# EAGLE design IoT_PCB (EAGLE 9.6.2)
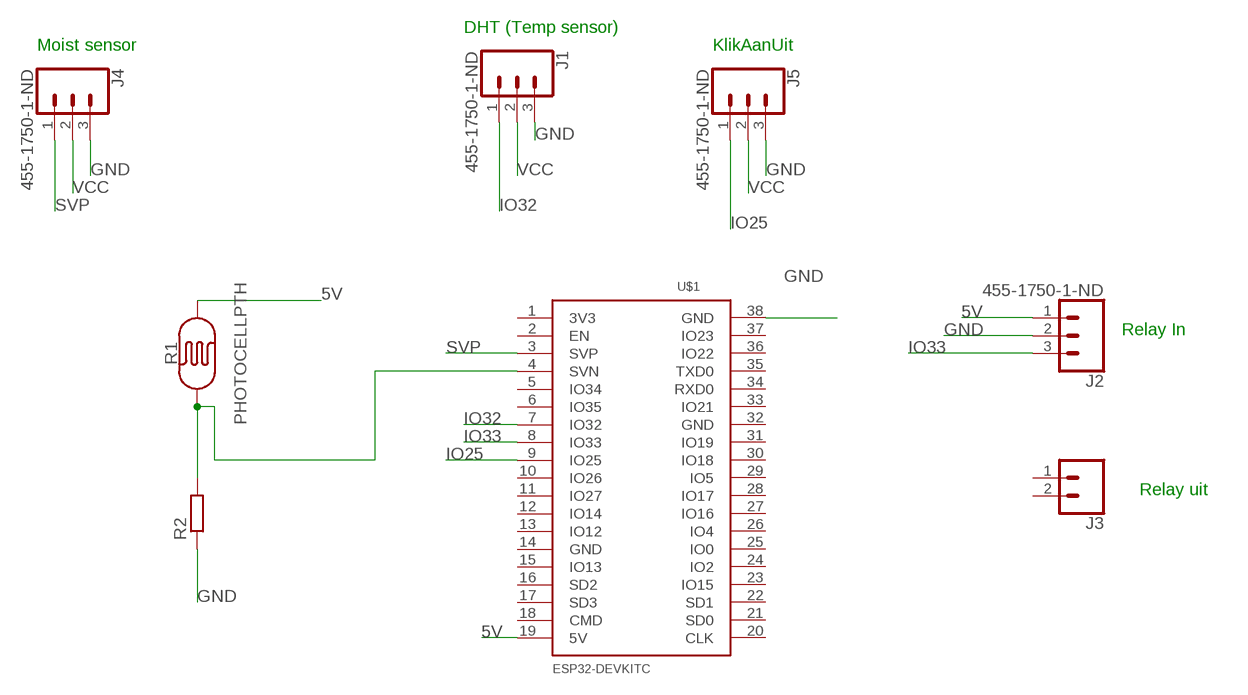
[diagram p0: schematic, sheet 1]

## Parts
J1  455-1750-1-ND  CONN_03  [1X03]
J2  455-1750-1-ND  CONN_03  [1X03]
J3  CONN_02  [1X02]
J4  455-1750-1-ND  CONN_03  [1X03]
J5  455-1750-1-ND  CONN_03  [1X03]
R1  PHOTOCELLPTH  [PHOTOCELL]
R2  R-EU_0207/10  [0207/10]
U$1  ESP32DEVKITC  [ESP32-DEVKITC]

## Nets
5V: J2.1 R1.2 U$1.19(5V)
GND: J1.3 J2.2 J4.3 J5.3 R2.1 U$1.38(GND)
IO25: J5.1 U$1.9(IO25)
IO32: J1.1 U$1.7(IO32)
IO33: J2.3 U$1.8(IO33)
N$1: R1.1 R2.2 U$1.4(SVN)
SVP: J4.1 U$1.3(SVP)
VCC: J1.2 J4.2 J5.2
Unconnected: J3.1 J3.2 U$1.1(3V3) U$1.2(EN) U$1.5(IO34) U$1.6(IO35) U$1.10(IO26) U$1.11(IO27) U$1.12(IO14) U$1.13(IO12) U$1.14(GND) U$1.15(IO13) U$1.16(SD2) U$1.17(SD3) U$1.18(CMD) U$1.20(CLK) U$1.21(SD0) U$1.22(SD1) U$1.23(IO15) U$1.24(IO2) U$1.25(IO0) U$1.26(IO4) U$1.27(IO16) U$1.28(IO17) U$1.29(IO5) U$1.30(IO18) U$1.31(IO19) U$1.32(GND) U$1.33(IO21) U$1.34(RXD0) U$1.35(TXD0) U$1.36(IO22) U$1.37(IO23)

## Notes on the sheet
- DHT (Temp sensor)
- Moist sensor | KlikAanUit
- Relay In
- Relay uit

## Library data of the parts
J1 J2 J4 J5 = SparkFun-Connectors:CONN_03: Multi connection point. Often used as Generic Header-pin footprint for 0.1 inch spaced/style header connections On any of the 0.1 inch spaced packages, you can populate with these: Break Away Headers - Straight <https://www.sparkfun.com/products/116> (PRT-00116) Break Away Male Headers - Right Angle <https://www.sparkfun.com/products/553> (PRT-00553) Female Headers <https://www.sparkfun.com/products/115> (PRT-00115) Break Away Headers - Machine Pin <https://www.sparkfun.com/products/117> (PRT-00117) Break Away Female Headers - Swiss Machine Pin <https://www.sparkfun.com/products/743> (PRT-00743) Stackable Header - 3 Pin (Female, 0.1") <https://www.sparkfun.com/products/13875> (PRT-13875) For SCREWTERMINALS and SPRING TERMINALS visit here: Screw Terimnals on SparkFun.com <https://www.sparkfun.com/search/results?term=Screw+Terminals> (5mm/3.5mm/2.54mm spacing) This device is also useful as a general connection point to wire up your design to another part of your project. Our various solder wires solder well into these plated through hole pads. Hook-Up Wire - Assortment (Stranded, 22 AWG) <https://www.sparkfun.com/products/11375> (PRT-11375) Hook-Up Wire - Assortment (Solid Core, 22 AWG) <https://www.sparkfun.com/products/11367> (PRT-11367) View the entire wire category on our website here <https://www.sparkfun.com/categories/141> Special notes: Molex polarized connector foot print use with SKU : PRT-08232 with associated crimp pins and housings.; PROD_ID: XXX-00000
J3 = SparkFun-Connectors:CONN_02: Multi connection point. Often used as Generic Header-pin footprint for 0.1 inch spaced/style header connections On any of the 0.1 inch spaced packages, you can populate with these: Break Away Headers - Straight <https://www.sparkfun.com/products/116> (PRT-00116) Break Away Male Headers - Right Angle <https://www.sparkfun.com/products/553> (PRT-00553) Female Headers <https://www.sparkfun.com/products/115> (PRT-00115) Break Away Headers - Machine Pin <https://www.sparkfun.com/products/117> (PRT-00117) Break Away Female Headers - Swiss Machine Pin <https://www.sparkfun.com/products/743> (PRT-00743) For SCREWTERMINALS and SPRING TERMINALS visit here: Screw Terimnals on SparkFun.com <https://www.sparkfun.com/search/results?term=Screw+Terminals> (5mm/3.5mm/2.54mm spacing) This device is also useful as a general connection point to wire up your design to another part of your project. Our various solder wires solder well into these plated through hole pads. Hook-Up Wire - Assortment (Stranded, 22 AWG) <https://www.sparkfun.com/products/11375> (PRT-11375) Hook-Up Wire - Assortment (Solid Core, 22 AWG) <https://www.sparkfun.com/products/11367> (PRT-11367) View the entire wire category on our website here <https://www.sparkfun.com/categories/141> Special notes: Molex polarized connector foot print use with: PRT-08233 with associated crimp pins and housings. 2.54_SCREWTERM for use with PRT-10571. 3.5mm Screw Terminal footprints for PRT-08084 5mm Screw Terminal footprints for use with PRT-08432
R1 = SparkFun-Sensors:PHOTOCELL: Photocell (Photodetector, Photo Resistor, CdS) This is a very small light sensor. A photocell changes (also called a photodetector, photo resistor, CdS or photoconductive cell) resistance depending on the amount of light it is exposed to. These little sensors make great ambient light triggers (when light in the room turns on, do something). Datasheet <http://cdn.sparkfun.com/datasheets/Sensors/LightImaging/SEN-09088.pdf> SparkFun Products Mini Photocell <https://www.sparkfun.com/products/9088> (SEN-09088); PROD_ID: COMP-09129; SF_ID: SEN-09088
R2 = rcl:R-EU_: RESISTOR, European symbol; SPICEPREFIX: R
U$1 = ESP32-DEVKITC_1000mil:ESP32DEVKITC

## Board
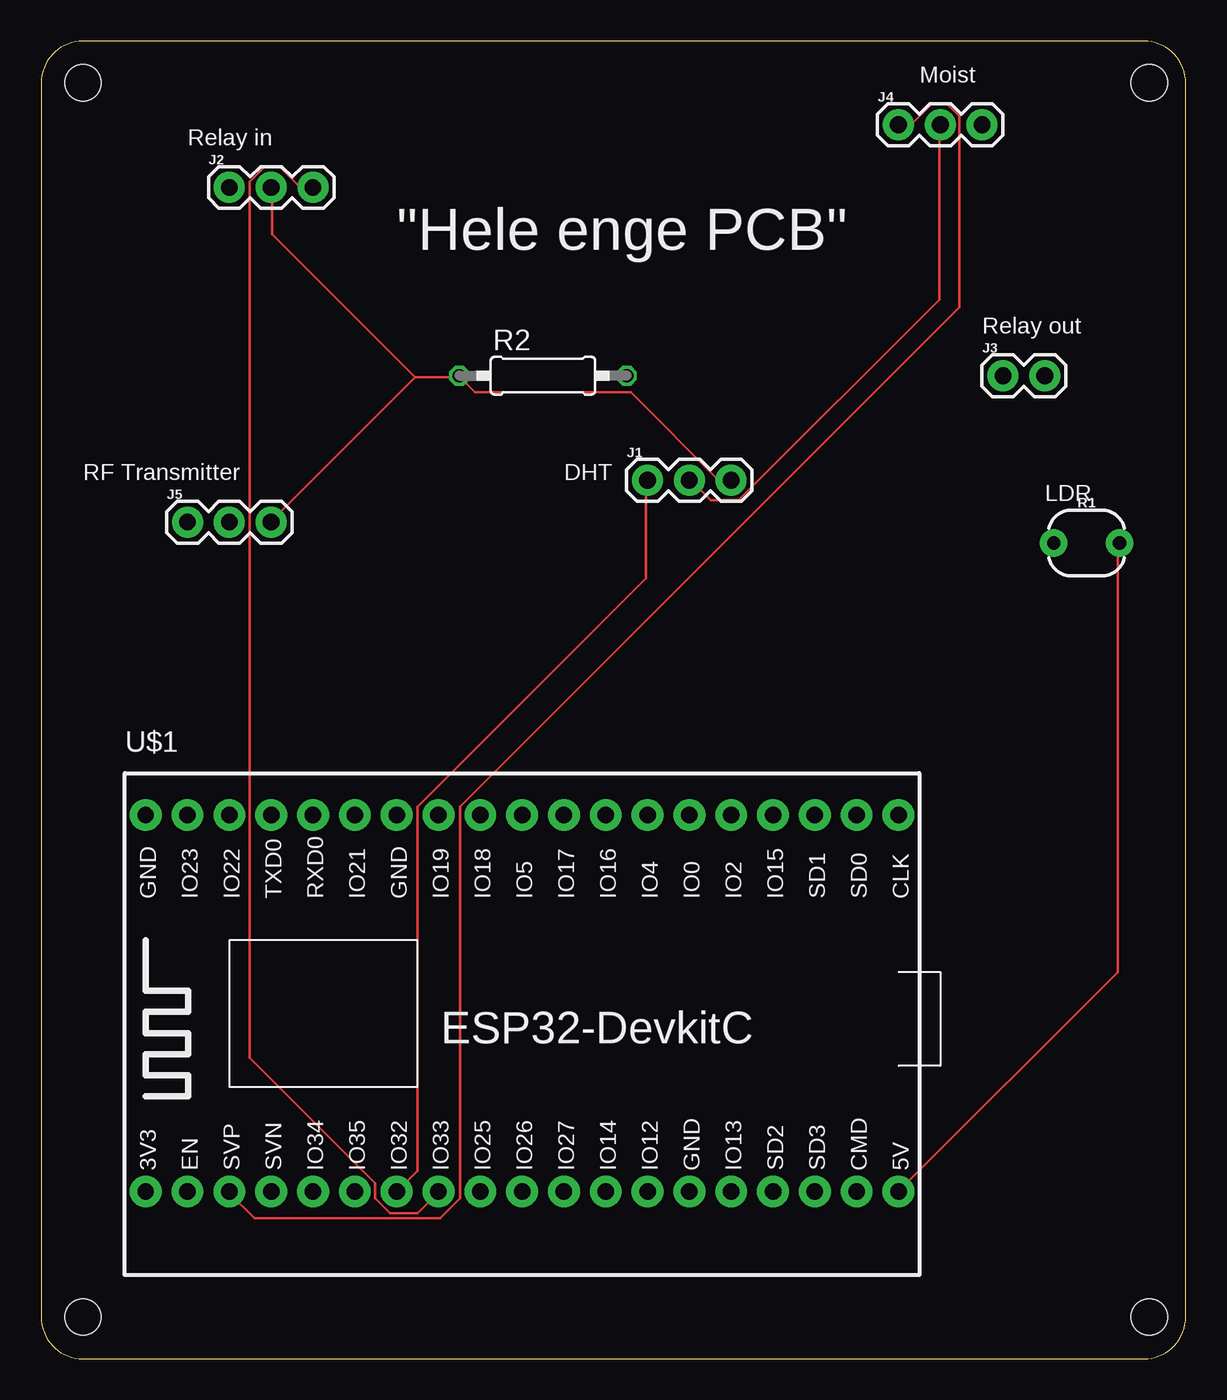
[diagram p1: board, top side]
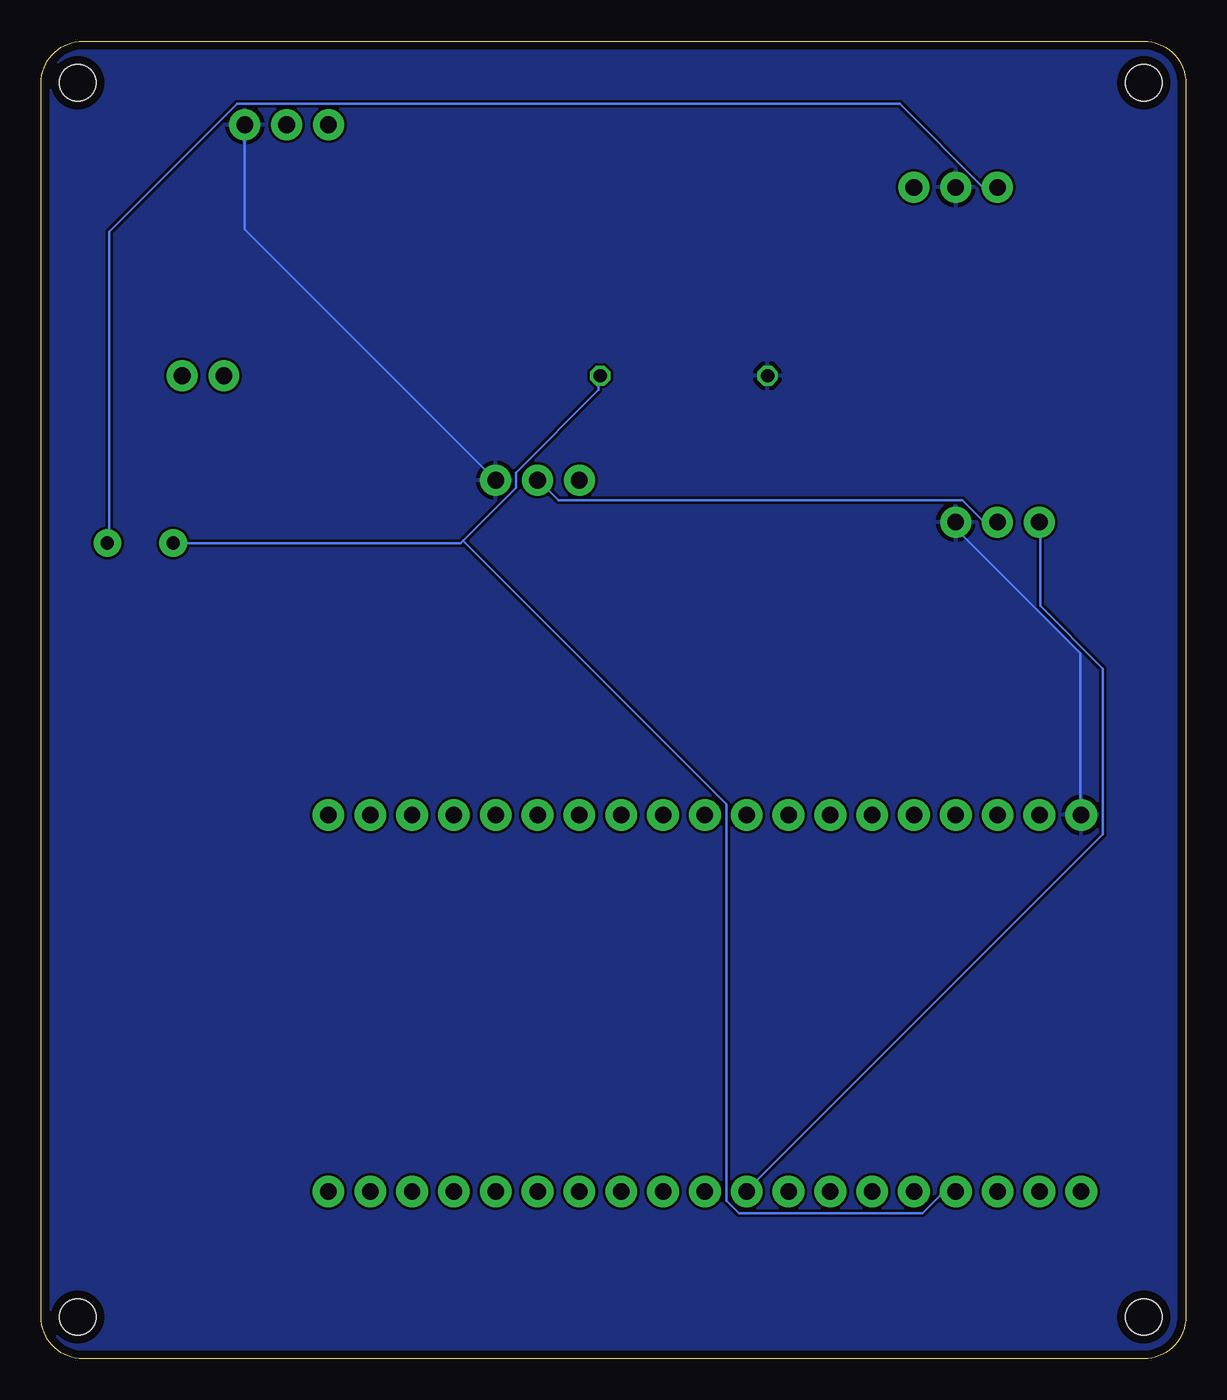
[diagram p2: board, bottom side, seen from below]

Size 69.52 x 80 mm. Coordinates in mm from the lower left corner, seen from the top.
Outline: 0,77.46 0,2.54 arc90 2.54,0 66.98,0 arc90 69.52,2.54 69.52,77.46 arc90 66.98,80 2.54,80 arc90 0,77.46
Copper layers (1*16): Top 0.035mm / dielectric 1.6mm / Bottom 0.035mm
Design rules "Elecrow_2-layer_PCB_eagle_rule": minimum track width 6mil, minimum drill 12mil, track to track 6mil, track to pad 6mil, pad to pad 6mil, via to via 8mil, smd to smd 0mil, copper to edge 20mil, drill to drill 10mil, minimum pad ring 6mil, minimum via ring 6mil, stop-mask expansion 0mil, vias tented up to drill 100mil, thermal gap 10mil
Holes 2.2 mm at 2.54,77.47 67.31,77.47 67.31,2.54 2.54,2.54

### Footprints (pad centres in the part's own frame; a part is rotated, then mirrored left to right if it is on the bottom)
1X03 = drill 1.016 pad 1.88: 1 0,0; 2 2.54,0; 3 5.08,0
1X02 = drill 1.016 pad 1.88: 1 0,0; 2 2.54,0
PHOTOCELL = drill 0.8 pad 1.676: 1 -2,0; 2 2,0
0207/10 = drill 0.813 octagon: 1 -5.08,0; 2 5.08,0
ESP32-DEVKITC = drill 1 pad 1.93: 1 -22.86,-10.16; 2 -20.32,-10.16; 3 -17.78,-10.16; 4 -15.24,-10.16; 5 -12.7,-10.16; 6 -10.16,-10.16; 7 -7.62,-10.16; 8 -5.08,-10.16; 9 -2.54,-10.16; 10 0,-10.16; 11 2.54,-10.16; 12 5.08,-10.16; 13 7.62,-10.16; 14 10.16,-10.16; 15 12.7,-10.16; 16 15.24,-10.16; 17 17.78,-10.16; 18 20.32,-10.16; 19 22.86,-10.16; 20 22.86,12.7; 21 20.32,12.7; 22 17.78,12.7; 23 15.24,12.7; 24 12.7,12.7; 25 10.16,12.7; 26 7.62,12.7; 27 5.08,12.7; 28 2.54,12.7; 29 0,12.7; 30 -2.54,12.7; 31 -5.08,12.7; 32 -7.62,12.7; 33 -10.16,12.7; 34 -12.7,12.7; 35 -15.24,12.7; 36 -17.78,12.7; 37 -20.32,12.7; 38 -22.86,12.7

### Placement (x,y rotation side)
J1  36.83,53.34 0 top
J2  11.43,71.12 0 top
J3  58.42,59.69 0 top
J4  52.07,74.93 0 top
J5  8.89,50.8 0 top
R1  63.5,49.53 0 top
R2  30.48,59.69 0 top
U$1  29.21,20.32 0 top

### Tracks (layer width: path | path; a pad name or v marks a point on that pad's centre or on a via)
5V
  Top 0.152: U$1.19 65.38,23.47 65.38,49.53 R1.2
  Bottom 0.152: J2.1 11.43,71.17 12.34,71.17 17.37,76.2 57.61,76.2 65.38,68.43 65.38,49.53 R1.2
GND
  Top 0.152: 22.71,59.59 25.3,59.59 R2.1 25.45,59.59 26.36,58.67 35.81,58.67 41.15,53.34 J1.3 | 22.71,59.59 14.02,50.9 J5.3 | 22.71,59.59 14.02,68.28 14.02,71.02 J2.2
  Bottom 0.152: J4.3 57.15,68.58 J1.3 | U$1.38 6.4,33.07 6.4,42.82 13.87,50.29 13.87,50.75 J5.3
  pour Bottom: 0,81.28 67.31,81.28 71.12,77.47 71.12,1.27 69.85,0 1.27,0 -2.54,3.81 -2.54,78.74
IO25
  Bottom 0.152: J5.1 8.84,50.75 8.84,45.72 5.03,41.91 5.03,31.85 26.67,10.21 U$1.9
IO32
  Top 0.152: U$1.7 22.86,11.43 22.86,33.53 36.73,47.4 36.73,53.34 J1.1
IO33
  Top 0.152: J2.3 16.46,71.17 15.7,71.17 14.48,72.39 13.56,72.39 12.65,71.48 12.65,18.29 20.27,10.67 20.27,9.75 21.18,8.84 22.86,8.84 24.08,10.06 U$1.8
N$1
  Bottom 0.152: 43.89,49.68 44.04,49.53 R1.1 | 43.89,49.68 40.69,52.88 40.69,53.8 35.66,58.83 35.66,59.59 R2.2 | 43.89,49.68 27.89,33.68 27.89,9.6 27.13,8.84 16,8.84 14.78,10.06 14.02,10.06 U$1.4
SVP
  Top 0.152: J4.1 52.12,74.98 52.88,74.98 54.1,76.2 55.02,76.2 55.78,75.44 55.78,63.86 25.45,33.53 25.45,9.75 24.23,8.53 12.95,8.53 11.43,10.06 U$1.3
VCC
  Top 0.152: J4.2 54.56,74.83 54.56,64.31 42.37,52.12 40.69,52.12 39.47,53.34 J1.2
  Bottom 0.152: J5.2 11.43,50.9 12.34,50.9 13.56,52.12 38.1,52.12 39.32,53.34 J1.2

### Text on the board
tPlace: Moist | Relay in | "Hele enge PCB" | Relay out | RF Transmitter | DHT | LDR